# Altium schematic sheet guess_the_number.SchDoc
size 381 x 241 mm; SheetNumber: 1; SheetTotal: 1; SPICEModelCacheKWQEMERK: <root> / <DocumentId>KWQEMERK</DocumentId> / </root>
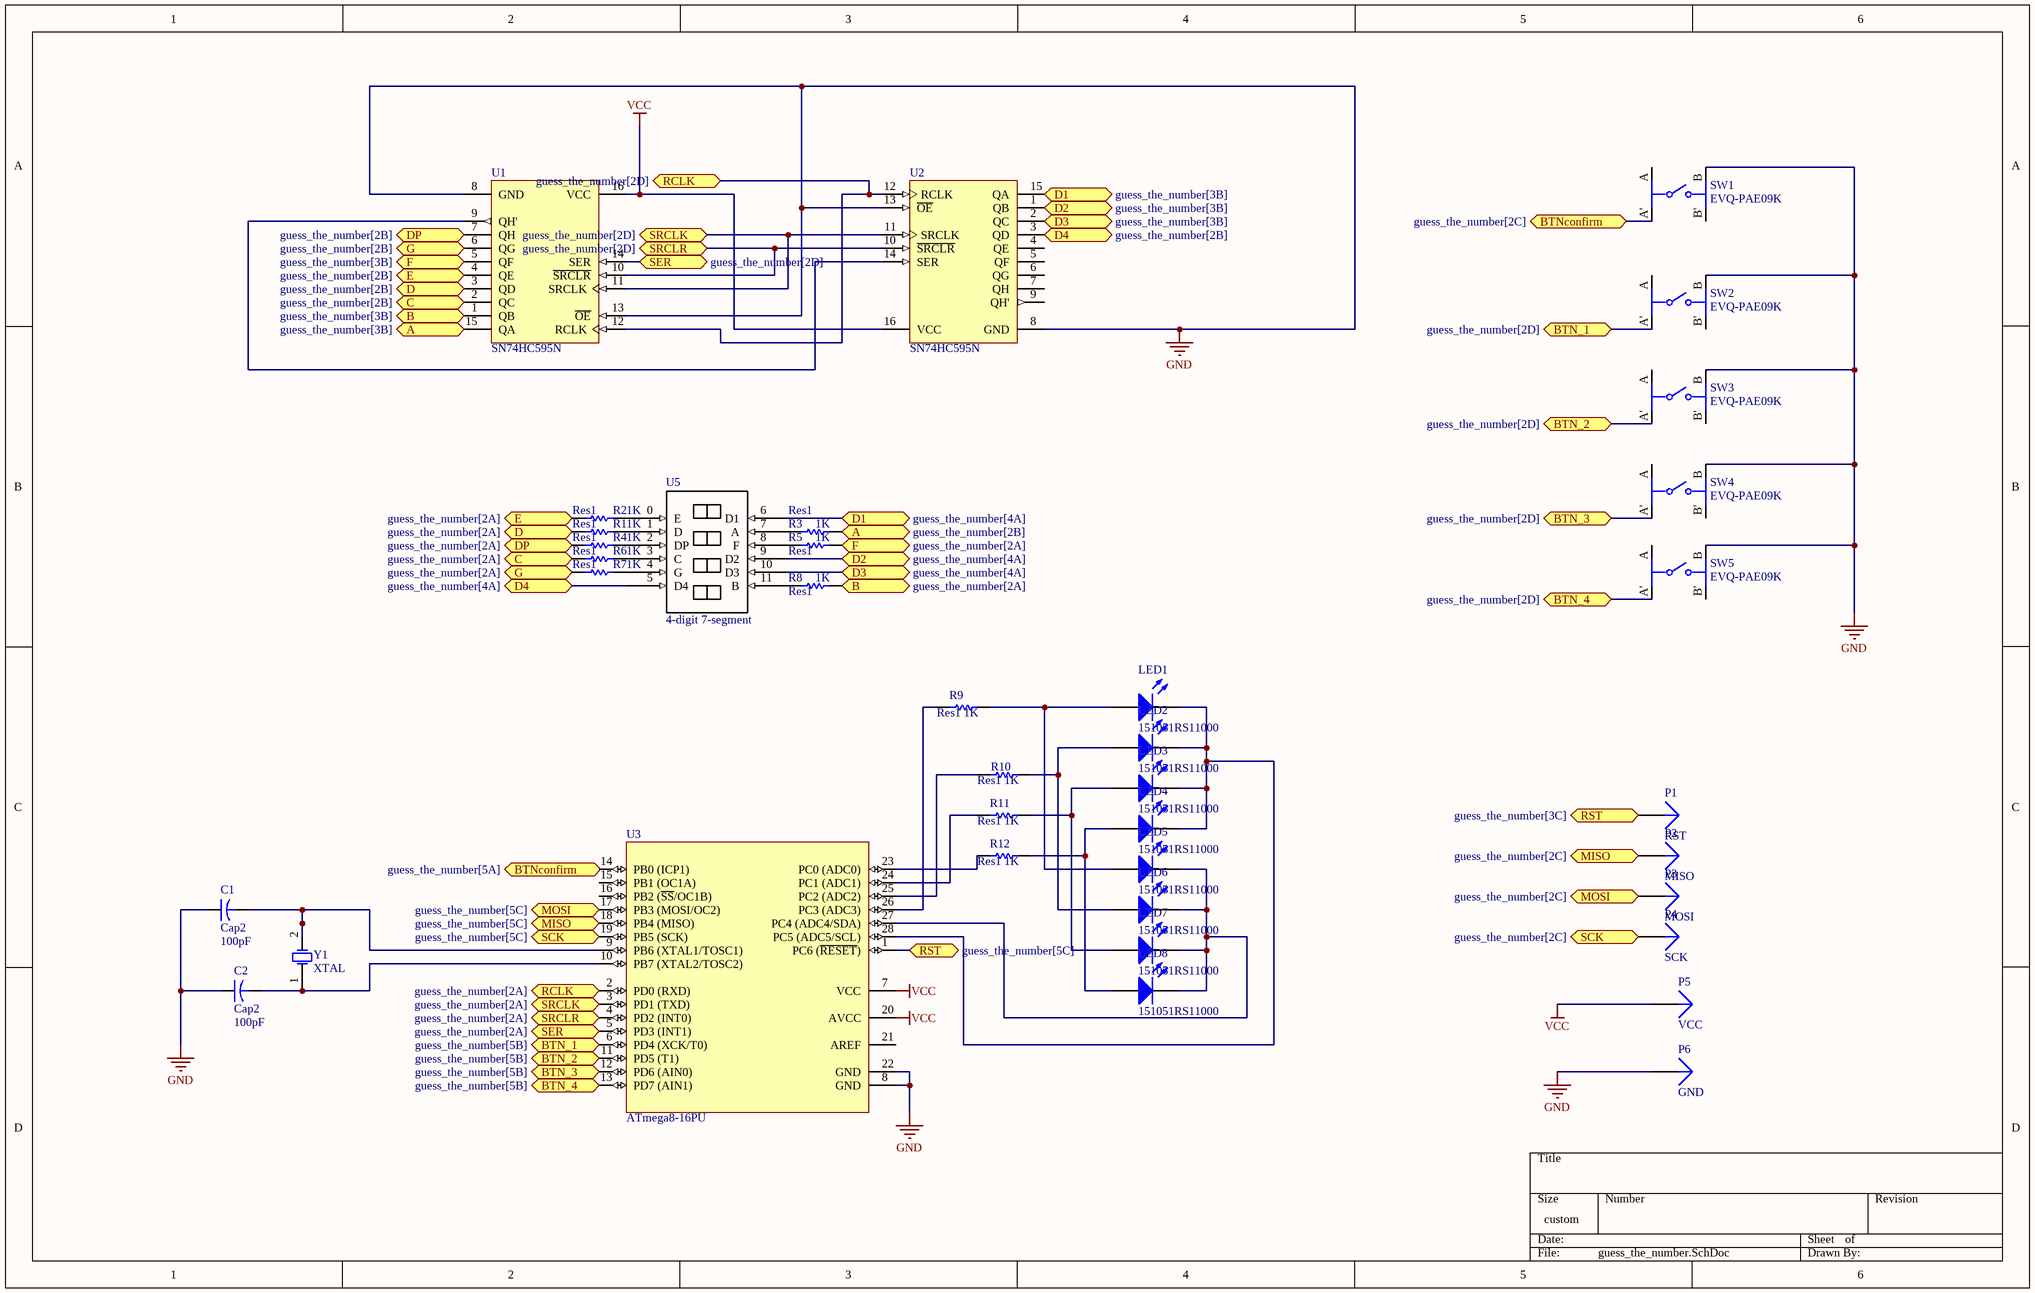
[diagram p0: guess_the_number.SchDoc]

## Parts
C1  Cap2  value 100pF  [CAPR5-4X5]
C2  Cap2  value 100pF  [CAPR5-4X5]
LED1  151051RS11000  [Type 5mm]
LED2  151051RS11000  [Type 5mm]
LED3  151051RS11000  [Type 5mm]
LED4  151051RS11000  [Type 5mm]
LED5  151051RS11000  [Type 5mm]
LED6  151051RS11000  [Type 5mm]
LED7  151051RS11000  [Type 5mm]
LED8  151051RS11000  [Type 5mm]
P1  RST  [PIN1]
P2  MISO  [PIN1]
P3  MOSI  [PIN1]
P4  SCK  [PIN1]
P5  VCC  [PIN1]
P6  GND  [PIN1]
R1  Res1  value 1K  [AXIAL-0.3]
R2  Res1  value 1K  [AXIAL-0.3]
R3  Res1  value 1K  [AXIAL-0.3]
R4  Res1  value 1K  [AXIAL-0.3]
R5  Res1  value 1K  [AXIAL-0.3]
R6  Res1  value 1K  [AXIAL-0.3]
R7  Res1  value 1K  [AXIAL-0.3]
R8  Res1  value 1K  [AXIAL-0.3]
R9  Res1  value 1K  [AXIAL-0.3]
R10  Res1  value 1K  [AXIAL-0.3]
R11  Res1  value 1K  [AXIAL-0.3]
R12  Res1  value 1K  [AXIAL-0.3]
SW1  EVQ-PAE09K  [FP-EVQ-PAE09K-MFG]
SW2  EVQ-PAE09K  [FP-EVQ-PAE09K-MFG]
SW3  EVQ-PAE09K  [FP-EVQ-PAE09K-MFG]
SW4  EVQ-PAE09K  [FP-EVQ-PAE09K-MFG]
SW5  EVQ-PAE09K  [FP-EVQ-PAE09K-MFG]
U1  SN74HC595N  [N0016A]
U2  SN74HC595N  [N0016A]
U3  ATmega8-16PU  [28P3]
U5  4-digit 7-segment  [PCBComponent_1]
Y1  XTAL  [R38]

## Ports
A (bidir, see guess_the_number[2B]), A (bidir, see guess_the_number[3B]), B (bidir, see guess_the_number[2A]), B (bidir, see guess_the_number[3B]), BTN_1 (bidir, see guess_the_number[2D]), BTN_1 (bidir, see guess_the_number[5B]), BTN_2 (bidir, see guess_the_number[2D]), BTN_2 (bidir, see guess_the_number[5B]), BTN_3 (bidir, see guess_the_number[2D]), BTN_3 (bidir, see guess_the_number[5B]), BTN_4 (bidir, see guess_the_number[2D]), BTN_4 (bidir, see guess_the_number[5B]), BTNconfirm (bidir, see guess_the_number[2C]), BTNconfirm (bidir, see guess_the_number[5A]), C (bidir, see guess_the_number[2A]), C (bidir, see guess_the_number[2B]), D1 (bidir, see guess_the_number[3B]), D1 (bidir, see guess_the_number[4A]), D2 (bidir, see guess_the_number[3B]), D2 (bidir, see guess_the_number[4A]), D3 (bidir, see guess_the_number[3B]), D3 (bidir, see guess_the_number[4A]), D4 (bidir, see guess_the_number[2B]), D4 (bidir, see guess_the_number[4A]), D (bidir, see guess_the_number[2A]), D (bidir, see guess_the_number[2B]), DP (bidir, see guess_the_number[2A]), DP (bidir, see guess_the_number[2B]), E (bidir, see guess_the_number[2A]), E (bidir, see guess_the_number[2B]), F (bidir, see guess_the_number[2A]), F (bidir, see guess_the_number[3B]), G (bidir, see guess_the_number[2A]), G (bidir, see guess_the_number[2B]), MISO (bidir, see guess_the_number[2C]), MISO (bidir, see guess_the_number[5C]), MOSI (bidir, see guess_the_number[2C]), MOSI (bidir, see guess_the_number[5C]), RCLK (bidir, see guess_the_number[2A]), RCLK (bidir, see guess_the_number[2D]), RST (bidir, see guess_the_number[3C]), RST (bidir, see guess_the_number[5C]), SCK (bidir, see guess_the_number[2C]), SCK (bidir, see guess_the_number[5C]), SER (bidir, see guess_the_number[2A]), SER (bidir, see guess_the_number[2D]), SRCLK (bidir, see guess_the_number[2A]), SRCLK (bidir, see guess_the_number[2D]), SRCLR (bidir, see guess_the_number[2A]), SRCLR (bidir, see guess_the_number[2D])

## Nets
GND: C1.1 C2.1 P6.1 SW1.B SW2.B SW3.B SW4.B SW5.B U1.8(GND) U1.13(~{OE}) U2.8(GND) U2.13(~{OE}) U3.8(GND) U3.22(GND)
VCC: P5.1 U1.16(VCC) U2.16(VCC) U3.7(VCC) U3.20(AVCC)
A: R3.2 U1.15(QA) ; port A
B: R8.2 U1.1(QB) ; port B
BTN_1: SW2.A' U3.6(PD4_(XCK/T0)) ; port BTN_1
BTN_2: SW3.A' U3.11(PD5_(T1)) ; port BTN_2
BTN_3: SW4.A' U3.12(PD6_(AIN0)) ; port BTN_3
BTN_4: SW5.A' U3.13(PD7_(AIN1)) ; port BTN_4
BTNconfirm: SW1.A' U3.14(PB0_(ICP1)) ; port BTNconfirm
C: R6.1 U1.2(QC) ; port C
D: R1.1 U1.3(QD) ; port D
D1: U2.15(QA) U5.6(D1) ; port D1
D2: U2.1(QB) U5.9(D2) ; port D2
D3: U2.2(QC) U5.10(D3) ; port D3
D4: U2.3(QD) U5.5(D4) ; port D4
DP: R4.1 U1.7(QH) ; port DP
E: R2.1 U1.4(QE) ; port E
F: R5.2 U1.5(QF) ; port F
G: R7.1 U1.6(QG) ; port G
MISO: P2.1 U3.18(PB4_(MISO)) ; port MISO
MOSI: P3.1 U3.17(PB3_(MOSI/OC2)) ; port MOSI
RCLK: U1.12(RCLK) U2.12(RCLK) U3.2(PD0_(RXD)) ; port RCLK
RST: P1.1 U3.1(PC6_(~{RESET})) ; port RST
SCK: P4.1 U3.19(PB5_(SCK)) ; port SCK
SER: U1.14(SER) U3.5(PD3_(INT1)) ; port SER
SRCLK: U1.11(SRCLK) U2.11(SRCLK) U3.3(PD1_(TXD)) ; port SRCLK
SRCLR: U1.10(~{SRCLR}) U2.10(~{SRCLR}) U3.4(PD2_(INT0)) ; port SRCLR
NetC1_2: C1.2 U3.9(PB6_(XTAL1/TOSC1)) Y1.2(OSC2)
NetC2_2: C2.2 U3.10(PB7_(XTAL2/TOSC2)) Y1.1(OSC1)
NetLED1_1: LED1.1(K) LED2.1(K) LED3.1(K) LED4.1(K) U3.28(PC5_(ADC5/SCL))
NetLED1_2: LED1.2(A) LED5.2(A) R9.2
NetLED2_2: LED2.2(A) LED6.2(A) R10.2
NetLED3_2: LED3.2(A) LED7.2(A) R11.2
NetLED4_2: LED4.2(A) LED8.2(A) R12.2
NetLED5_1: LED5.1(K) LED6.1(K) LED7.1(K) LED8.1(K) U3.27(PC4_(ADC4/SDA))
NetR1_2: R1.2 U5.1(D)
NetR2_2: R2.2 U5.0(E)
NetR3_1: R3.1 U5.7(A)
NetR4_2: R4.2 U5.2(DP)
NetR5_1: R5.1 U5.8(F)
NetR6_2: R6.2 U5.3(C)
NetR7_2: R7.2 U5.4(G)
NetR8_1: R8.1 U5.11(B)
NetR9_1: R9.1 U3.26(PC3_(ADC3))
NetR10_1: R10.1 U3.25(PC2_(ADC2))
NetR11_1: R11.1 U3.24(PC1_(ADC1))
NetR12_1: R12.1 U3.23(PC0_(ADC0))
NetU1_9: U1.9(QH') U2.14(SER)

Not connected (* = marked no-connect by the designer): SW1 A B'; SW2 A B'; SW3 A B'; SW4 A B'; SW5 A B'; U2 4(QE) 5(QF) 6(QG) 7(QH) 9(QH'); U3 15(PB1_(OC1A)) 16(PB2_(~{SS}/OC1B)) 21(AREF)

## Library data of the parts
C1 C2 = Cap2: Capacitor; Published: 23-Sep-2002; PackageReference: CAPR5-4X5; Publisher: Altium Limited; PackageDescription: Capacitor; 2 Leads
LED1-LED8 = CMP-1488-00008-1: THT LED round mono-color color lens, WL-TMRW, Red; Manufacturer: Wuerth Elektronik; PackageReference: Type 5mm; PartNumber: 151051RS11000; ComponentLink2URL: http://katalog.we-online.de/pbs/datasheet/7448042001.pdfhttp://katalog.we-online.de/pbs/datasheet/7448042001.pdfhttp://katalog.we-online.de/pbs/datasheet/7448042001.pdfhttp://katalog.we-online.de/pbs/datasheet/151051RS11000.pdf; ComponentLink1URL: http://www.we-online.com; ComponentLink1Description: Manufacturer URL; ComponentLink2Description: Datasheet; Emitting color: Red
P1-P6 = Plug: LatestRevisionDate: 17-Jul-2002; LatestRevisionNote: Re-released for DXP Platform.; Publisher: Altium Limited
R1-R12 = Res1: Resistor; Published: 8-Jun-2000; LatestRevisionDate: 17-Jul-2002; LatestRevisionNote: Re-released for DXP Platform.; PackageReference: AXIAL-0.3; Publisher: Altium Limited; PackageDescription: Axial Device, Thru-Hole; 2 Leads; 0.3 in Pin Spacing
SW1-SW5 = CMP-05618-000085-1: SWITCH TACTILE SPST-NO 0.02A 15V; Operating Force: 1.6N; Actuator Type: Standard; Current Rating: 20mA; Actuator Length: 5.6mm; Switch Function: Off-Mom; Illumination Type: Non-Illuminated; Actuator Color: Black; Throw Configuration: SPST; Contact Resistance: 50mR; Switch Travel: 0.25mm; Mechanical Life: 100000Cycles; Lead Free: Lead Free; Packaging: Bulk; Max Operating Temperature: 70°C; Height: 9.5mm; Width: 6mm; Series: EVQPA; Size: 6mm; Voltage Rating (DC): 15V; Mount: Through Hole; Contact Plating: Gold; Contact Current Rating: 20mA; RoHS Compliant: Yes; Color: Black; Depth: 7.8mm; Radiation Hardening: No; Length: 6mm; Max Voltage Rating (DC): 15V; Orientation: Straight; Termination: PC Pin; Max Current Rating: 20mA; Package Quantity: 500; Min Operating Temperature: -20°C; Electrical Life: 100000Cycles
U1 U2 = CMP-0780-00137-3: 8-Bit Shift Registers With 3-State Output Registers, N0016A, TUBE; Manufacturer: Texas Instruments; F @ Nom Voltage(Max)(Mhz): 28; Input Type: CMOS; Bits: 8; VCC(Min)(V): 2; 3-State Output: Yes; ICC @ Nom Voltage(Max)(mA): 0.08; VCC(Max)(V): 6; tpd @ Nom Voltage(Max)(ns): 34; Rating: Military; Technology Family: HC; Output Drive (IOL/IOH)(Max)(mA): 7.8/-7.8; Code_JEDEC: MS-001; Output Type: CMOS; Operating Temperature Range(C): -40 to 85; Voltage(Nom)(V): 6; Generic Part Number: SN74HC595; DatasheetVersion: SCLS041H; PackageReference: N0016A; PackageVersion: http://www.ti.com/lit/ml/mpdi002c/mpdi002c.pdf
U3 = CMP-0095-00372-1: 8-bit AVR Microcontroller, 4.5-5.5V, 16MHz, 8KB Flash, 512 Bytes EEPROM, 1KB SRAM, 28-pin PDIP, Industrial Grade (-40°C to 85°C); ComponentLink3URL: http://www.atmel.com/dyn/resources/prod_documents/2486S.pdf; ComponentLink3Description: ATmega8(L) Summary; PackageDescription: 28-lead (0.300"/7.62mm Wide) Plastic Dual Inline Package (PDIP); ComponentLink2Description: ATmega8(L); ComponentLink1URL: http://www.atmel.com/; PackageVersion: revB, Sep-2001; ComponentLink1Description: Manufacturer URL; ComponentLink2URL: http://www.atmel.com/dyn/resources/prod_documents/doc2486.pdf; PackageReference: 28P3; DatasheetVersion: revZ, Feb-2011
Y1 = XTAL: Crystal Oscillator; Published: 8-Jun-2000; LatestRevisionDate: 17-Jul-2002; LatestRevisionNote: Re-released for DXP Platform.; PackageReference: R38; Publisher: Altium Limited; PackageDescription: Crystal, Thru-Hole; 2 Leads; Body 3.1 x 8.2 mm (Dia.xH)